# EasyEDA Pro project ProProject_温室大棚_2024-05-11.epro

# Schematic Schematic1
Create Date: 2024-05-09; Page Name: P1; Project Name: 温室大棚; Schematic Name: Schematic1; Update Date: 2024-05-10; Company: 嘉立创EDA; Page Size: A4; Version: V1.0
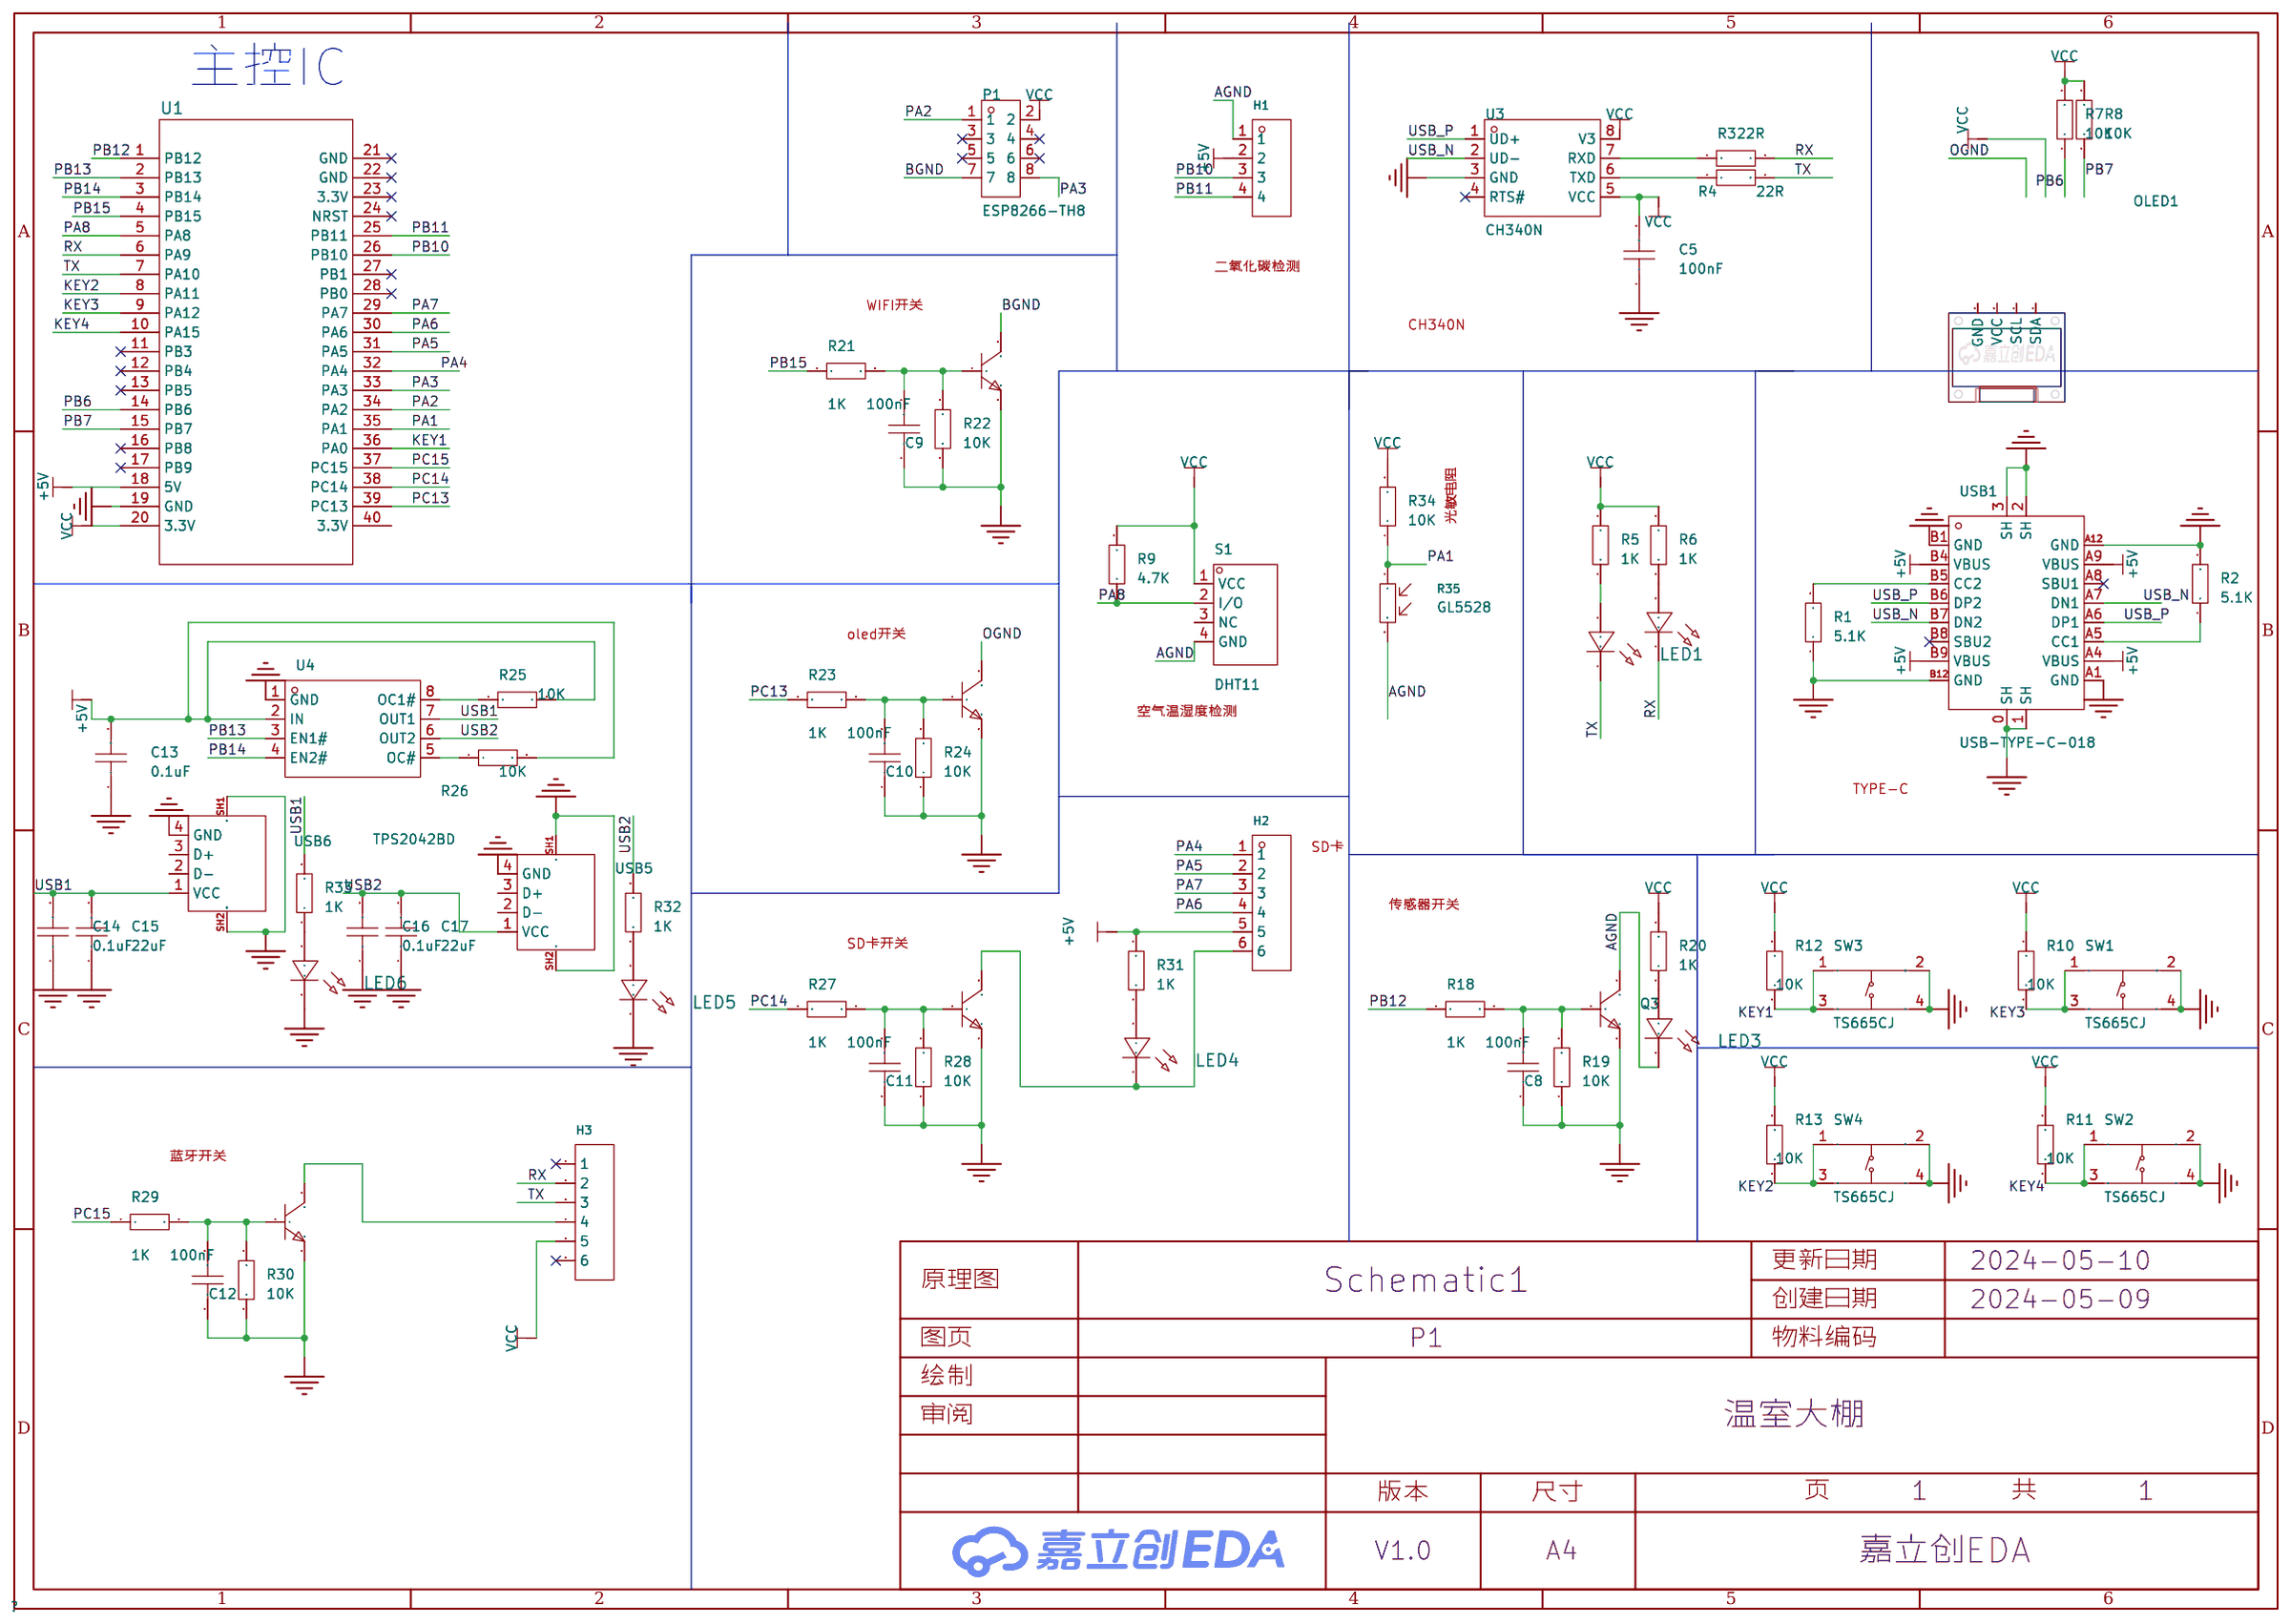
[diagram p0: schematic sheet]

## Parts
C5  100nF  [C0603]
C8  100nF  [C0603]
C9  100nF  [C0603]
C10  100nF  [C0603]
C11  100nF  [C0603]
C12  100nF  [C0603]
C13  0.1uF  [C0603]
C14  0.1uF  [C0603]
C15  22uF  [C0603]
C16  0.1uF  [C0603]
C17  22uF  [C0603]
H1  -  [HDR-TH_4P-P2.54-V-M]
H2  -  [HDR-TH_6P-P2.54-V-F]
H3  -  [HDR-TH_6P-P2.54-V-M-1]
LED1  -  [LED_0603]
LED2  -  [LED_0603]
LED3  -  [LED_0603]
LED4  -  [LED_0603]
LED5  -  [LED_0603]
LED6  -  [LED_0603]
OLED1  -  [0.96OLED_4P]
P1  ESP8266-TH8  [HDR-TH_8P-P2.54-V-F-R2-C4-S2.54-1]
Q3  -  [S8050_SOT-23]
Q4  -  [S8050_SOT-23]
Q5  -  [S8050_SOT-23]
Q6  -  [S8050_SOT-23]
Q7  -  [S8050_SOT-23]
R1  5.1K  [R0603]
R2  5.1K  [R0603]
R3  22R  [R0603]
R4  22R  [R0603]
R5  1K  [R0603]
R6  1K  [R0603]
R7  10K  [R0603]
R8  10K  [R0603]
R9  4.7K  [R0603]
R10  10K  [R0603]
R11  10K  [R0603]
R12  10K  [R0603]
R13  10K  [R0603]
R18  1K  [R0603]
R19  10K  [R0603]
R20  1K  [R0603]
R21  1K  [R0603]
R22  10K  [R0603]
R23  1K  [R0603]
R24  10K  [R0603]
R25  10K  [R0603]
R26  10K  [R0603]
R27  1K  [R0603]
R28  10K  [R0603]
R29  1K  [R0603]
R30  10K  [R0603]
R31  1K  [R0603]
R32  1K  [R0603]
R33  1K  [R0603]
R34  10K  [R0603]
R35  GL5528  [RES-TH_L5.1-W4.3-P3.40-D0.5]
S1  DHT11  [SENSOR-TH_DHT11-1]
SW1  TS665CJ  [SW-TH_4P-L6.0-W6.0-P4.50-LS6.5]
SW2  TS665CJ  [SW-TH_4P-L6.0-W6.0-P4.50-LS6.5]
SW3  TS665CJ  [SW-TH_4P-L6.0-W6.0-P4.50-LS6.5]
SW4  TS665CJ  [SW-TH_4P-L6.0-W6.0-P4.50-LS6.5]
U1  STM32F103C8T6最小系统  [STM32F103C8T6]
U3  CH340N  [SOP-8_L4.9-W3.9-P1.27-LS6.0-BL]
U4  TPS2042BD  [SOIC-8_L5.0-W4.0-P1.27-LS6.1-BL]
USB1  USB-TYPE-C-018  [USB-C_SMD-TYPE-C-31-M-12]
USB5  -  [USB_ Type-A]
USB6  -  [USB_ Type-A]

## Library data of the parts
C5 C8-C17 = CAP_0603: Supplier Footprint: 0603
H1 = HDR-M_2.54_1x4P: Supplier Part: C492403; Supplier Footprint: 插件
H2 = HDR-F_2.54_1x6P: Supplier Part: C40877; Supplier Footprint: 插件
H3 = HDR-M_2.54_1x6P: Supplier Part: C37208; Supplier Footprint: 插件
LED1-LED6 = LED_0603-R: Supplier Footprint: 0603
OLED1 = 0.96OLED模块_4P: Supplier Footprint: 插件
P1 = ESP8266-TH8: Supplier Part: C9900003199; Supplier Footprint: TH-8_4.9X10.6X2.54P; JLCPCB Part Class: 扩展库; Supplier: LCSC
Q3-Q7 = S8050_SOT_NPN: Supplier Footprint: SOT-23
R1-R13 R18-R34 = Res_0603: Supplier Footprint: 0603
R35 = GL5528: 暗电阻:1MΩ;亮电阻 @ 10Lux:8kΩ~20kΩ;光谱峰值(波长):540nm;; LCSC Part Name: 亮电阻:8kΩ~20kΩ 暗电阻:1MΩ; Supplier Part: C125627; Manufacturer: 森霸; Supplier Footprint: 插件,P=3mm; JLCPCB Part Class: 扩展库; Datasheet: https://atta.szlcsc.com/upload/public/pdf/source/20230427/842A99E3D53A83729D7968886D4EFCBB.pdf; Supplier: LCSC; Dark Resistance: 1MΩ; Illuminated Resistance @ 10Lux: 8kΩ~20kΩ; Applied Voltage: 150V; Spectral Peak: 540nm
S1 = DHT11_C87032: 温湿度模块，数字式，单总线; LCSC Part Name: DHT11  电阻式; Supplier Part: C87032; Supplier Footprint: 16.1x12.6x5.8mm; JLCPCB Part Class: 扩展库; Supplier: LCSC
SW1-SW4 = TS665CJ: 电路结构:单刀单掷;按钮形状:圆形按钮;安装方式:直插;开关长度:6mm;开关宽度:6mm;开关高度:5mm;触点电流:50mA;额定电压(DC):12V;带灯:-;机械寿命:-;; LCSC Part Name: 6*6*5mm 直插 轻触开关; Supplier Part: C393938; Manufacturer: SHOU HAN(首韩); Supplier Footprint: 插件; JLCPCB Part Class: 扩展库; Datasheet: https://atta.szlcsc.com/upload/public/pdf/source/20190521/C393938_BDABEAC600B4C55E200A80AA129B70BC.pdf; Supplier: LCSC; Circuit: 单刀单掷; Actuator Style: 圆形按钮; Mounting Style: 直插; Switch Length: 6mm; Switch Width: 6mm; Switch Height: 5mm; Contact Current: 50mA; Voltage Rating (DC): 12V
U1 = STM32F103C8T6最小系统_1
U3 = CH340N: LCSC Part Name: USB转串口芯片 CH340; Supplier Part: C2977777; Manufacturer: WCH(南京沁恒); Supplier Footprint: SOP-8; JLCPCB Part Class: 扩展库; Datasheet: https://atta.szlcsc.com/upload/public/pdf/source/20230530/6E401E9554E9F5311886CC8B3F89B62E.pdf; Supplier: LCSC
U4 = TPS2042BD: 通道数:2;输出电流:500mA;输入电压:2.7V~5.5V;导通电阻:70mΩ;; Supplier Part: C1556561; Manufacturer: TI(德州仪器); Supplier Footprint: SOIC-8; JLCPCB Part Class: 扩展库; Datasheet: https://www.ti.com/cn/lit/gpn/tps2041b; Supplier: LCSC; Number of Outputs: 2; Output Current: 500mA; Input Voltage: 2.7V~5.5V; Resistor On-State: 70mΩ; Operating Temperature	-: -40℃~+85℃
USB1 = USB-TYPE-C-018: 连接器类型:Type-C;标准:-;公母:母;端口数量:1;触点数量:16P;安装方式:卧贴;额定电流 - 电源:3A;工作温度范围:-25℃~+85℃;; LCSC Part Name: Type-C 母 卧贴; Supplier Part: C2927038; Manufacturer: DEALON(德艺隆); Supplier Footprint: SMD; JLCPCB Part Class: 扩展库; Datasheet: https://atta.szlcsc.com/upload/public/pdf/source/20211217/CCD3D517E355E8E0CC52ABD8D5784AD8.pdf; Supplier: LCSC; Connector Type: Type-C; Gender: 母; Number of Ports: 1; Number of Contacts: 16P; Mounting Style: 卧贴; Current Rating - Power (Max): 3A; Operating Temperature Range: -25℃~+85℃
USB5 USB6 = USB_ Type-A: Supplier Footprint: 插件

## Nets
+5V: C13.2 H1.2 H2.5 R25.2 R26.2 R31.2 U1.18(5V) U4.2(IN) USB1.A4(VBUS) USB1.A9(VBUS) USB1.B4(VBUS) USB1.B9(VBUS)
AGND: H1.1 LED3.1(C) Q3.3 R35.2 S1.4(GND)
GND: C5.1 C8.1 C9.1 C10.1 C11.1 C12.1 C13.1 C14.1 C15.1 C16.1 C17.1 LED5.1(C) LED6.1(C) Q3.2 Q4.2 Q5.2 Q6.2 Q7.2 R1.1 R2.2 R19.1 R22.1 R24.1 R28.1 R30.1 SW1.2(B) SW1.4(D) SW2.2(B) SW2.4(D) SW3.2(B) SW3.4(D) SW4.2(B) SW4.4(D) U1.19(GND) U3.3(GND) U4.1(GND) USB1.0(SH) USB1.1(SH) USB1.2(SH) USB1.3(SH) USB1.A1(GND) USB1.A12(GND) USB1.B1(GND) USB1.B12(GND) USB5.4(GND) USB5.SH1 USB5.SH2 USB6.4(GND) USB6.SH1 USB6.SH2
VCC: C5.2 H3.5 P1.2 R5.2 R6.2 R7.2 R8.2 R9.2 R10.2 R11.2 R12.2 R13.2 R20.2 R34.2 S1.1(VCC) U1.20(3.3V) U3.5(VCC) U3.8(V3)
BGND: P1.7 Q4.3
KEY1: R12.1 SW3.1(A) SW3.3(C) U1.36(PA0)
KEY2: R13.1 SW4.1(A) SW4.3(C) U1.8(PA11)
KEY3: R10.1 SW1.1(A) SW1.3(C) U1.9(PA12)
KEY4: R11.1 SW2.1(A) SW2.3(C) U1.10(PA15)
OGND: Q5.3
PA1: R34.1 R35.1 U1.35(PA1)
PA2: P1.1 U1.34(PA2)
PA3: P1.8 U1.33(PA3)
PA4: H2.1 U1.32(PA4)
PA5: H2.2 U1.31(PA5)
PA6: H2.4 U1.30(PA6)
PA7: H2.3 U1.29(PA7)
PA8: R9.1 S1.2(I/O) U1.5(PA8)
PB6: R7.1 U1.14(PB6)
PB7: R8.1 U1.15(PB7)
PB10: H1.3 U1.26(PB10)
PB11: H1.4 U1.25(PB11)
PB12: R18.1 U1.1(PB12)
PB13: U1.2(PB13) U4.3(EN1#)
PB14: U1.3(PB14) U4.4(EN2#)
PB15: R21.1 U1.4(PB15)
PC13: R23.1 U1.39(PC13)
PC14: R27.1 U1.38(PC14)
PC15: R29.1 U1.37(PC15)
RX: H3.2 LED2.1(C) R3.2 U1.6(PA9)
TX: H3.3 LED1.1(C) R4.2 U1.7(PA10)
USB1: C14.2 C15.2 R33.2 U4.7(OUT1) USB6.1(VCC)
USB2: C16.2 C17.2 R32.2 U4.6(OUT2) USB5.1(VCC)
USB_N: U3.2(UD-) USB1.A7(DN1) USB1.B7(DN2)
USB_P: U3.1(UD+) USB1.A6(DP1) USB1.B6(DP2)
$1N3456: R1.2 USB1.B5(CC2)
$1N3492: R2.1 USB1.A5(CC1)
$1N3904: R3.1 U3.7(RXD)
$1N3907: R4.1 U3.6(TXD)
$1N4068: LED1.2(A) R5.1
$1N4095: LED2.2(A) R6.1
$1N8530: C8.2 Q3.1 R18.2 R19.2
$1N8653: LED3.2(A) R20.1
$1N9412: C9.2 Q4.1 R21.2 R22.2
$1N9563: C10.2 Q5.1 R23.2 R24.2
$1N11609: C11.2 Q6.1 R27.2 R28.2
$1N11936: C12.2 Q7.1 R29.2 R30.2
$1N12097: H3.4 Q7.3
$1N12215: H2.6 LED4.1(C) Q6.3
$1N12331: LED4.2(A) R31.1
$1N12367: R25.1 U4.8(OC1#)
$1N12370: R26.1 U4.5(OC#)
$1N12667: LED5.2(A) R32.1
$1N12718: LED6.2(A) R33.1

Not connected (* = marked no-connect by the designer): H3 1* 6*; OLED1 1(GND) 2(VCC) 3(SCL) 4(SDA); P1 3* 4* 5* 6*; S1 3(NC); U1 11(PB3)* 12(PB4)* 13(PB5)* 16(PB8)* 17(PB9)* 21(GND)* 22(GND)* 23(3.3V)* 24(NRST)* 27(PB1)* 28(PB0)* 40(3.3V); U3 4(RTS#)*; USB1 A8(SBU1)* B8(SBU2)*; USB5 2(D-) 3(D+); USB6 2(D-) 3(D+)

## Notes on the sheet
- 主控IC
- 二氧化碳检测
- WIFI开关
- CH340N
- 光敏电阻
- oled开关
- 空气温湿度检测
- TYPE-C
- SD卡
- 传感器开关
- SD卡开关
- 蓝牙开关

# Board PCB1
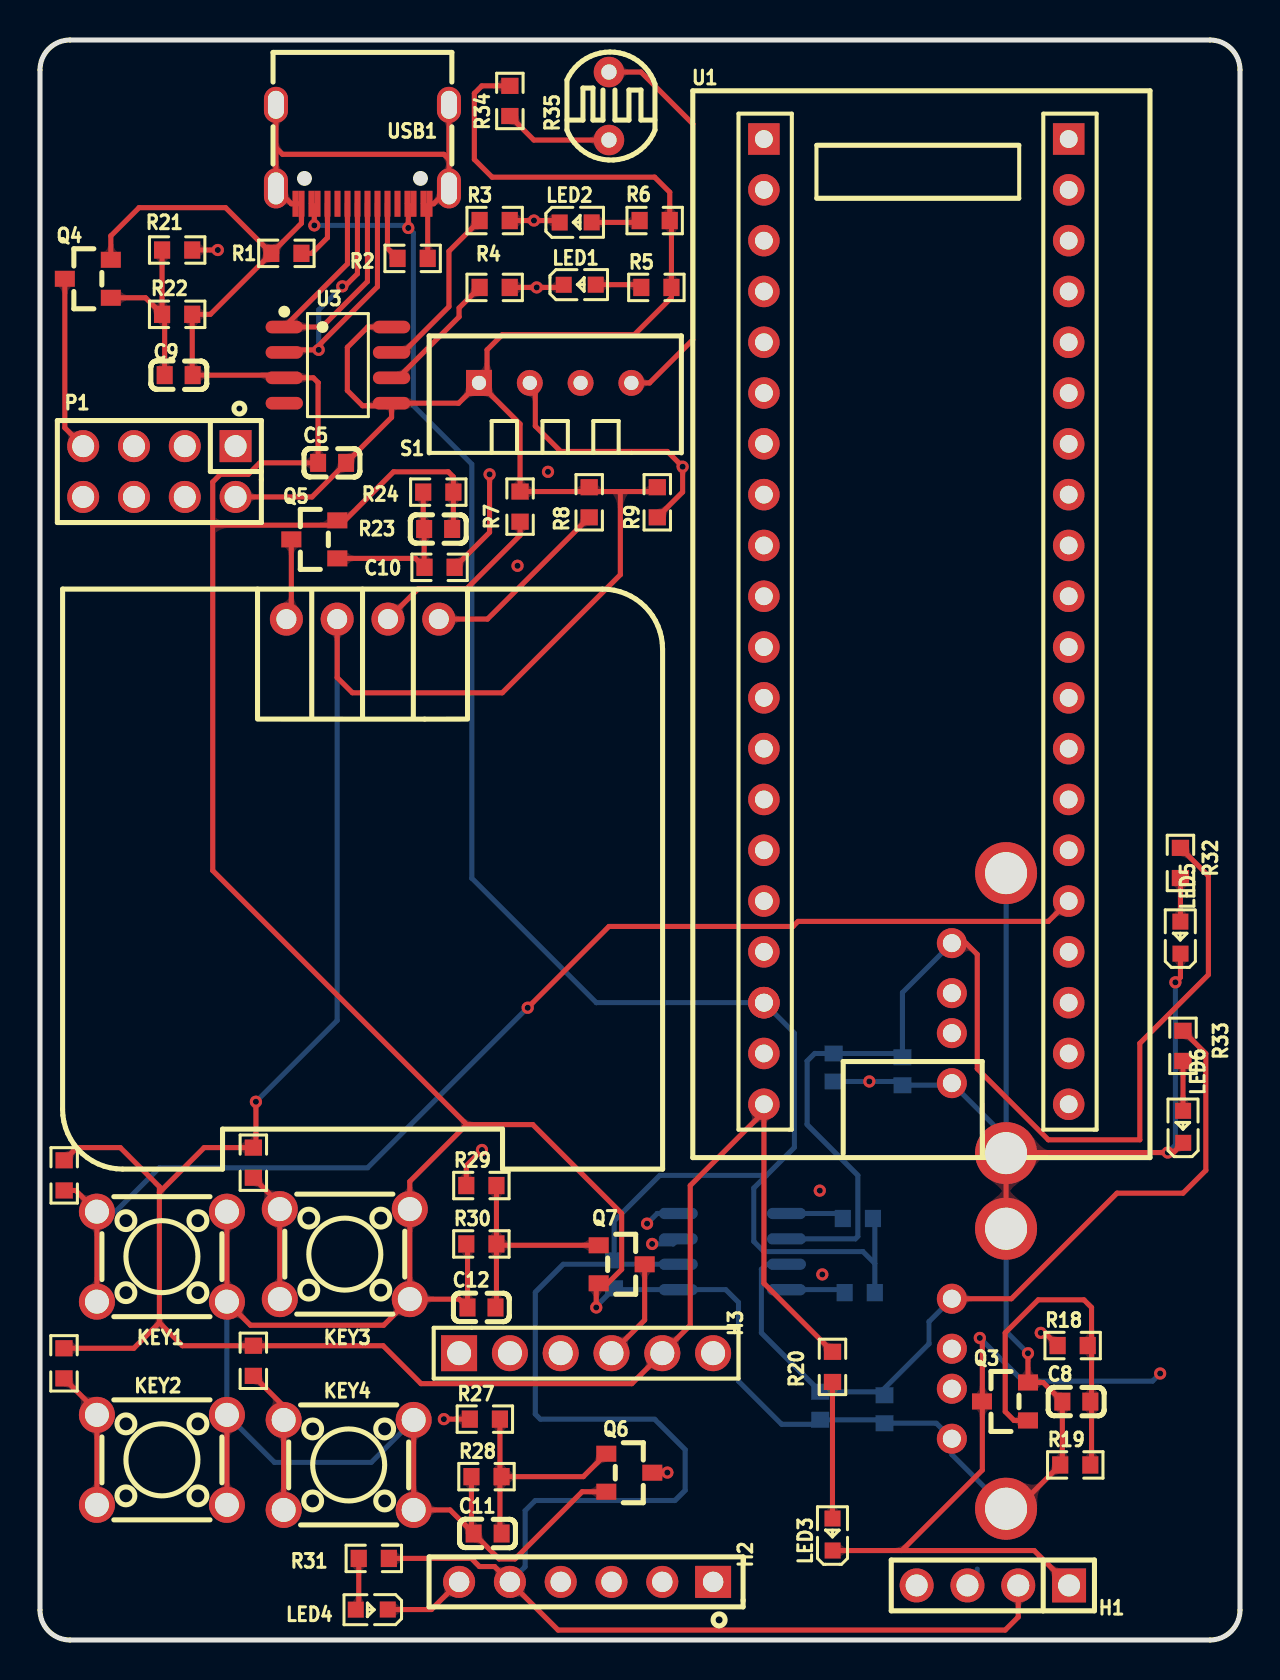
[diagram p1: board, top side]
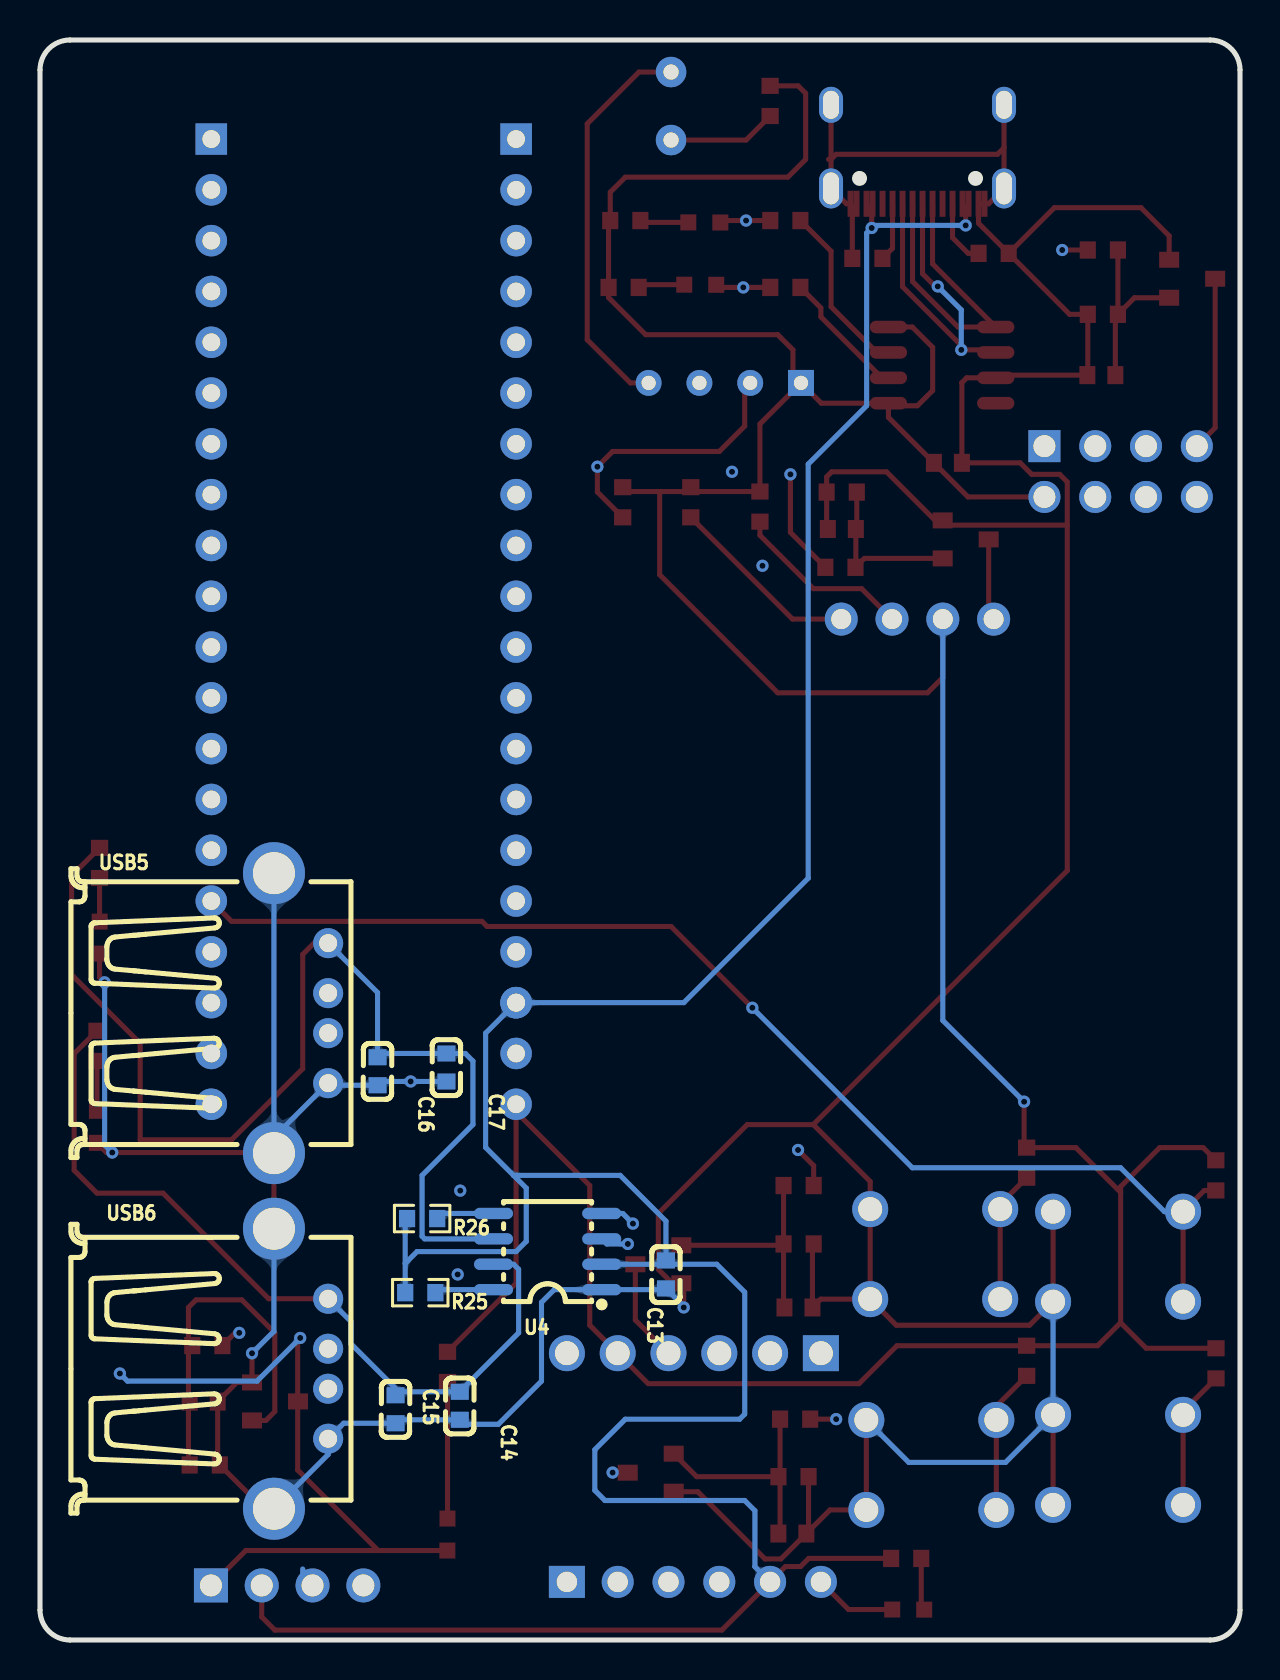
[diagram p2: board, bottom side, seen from below]

Outline 60 x 80 mm; copper layers: Top Layer, Inner1, Inner2, Bottom Layer. Coordinates in mm from the lower left corner of the outline.
Outline path: 0,78.5 0,1.5 arc(0.44,0.44) 1.5,0 58.5,0 arc(59.56,0.44) 60,1.5 60,78.5 arc(59.56,79.56) 58.5,80 1.5,80 arc(0.44,79.56) 0,78.5
Stack: Top Layer 0.035mm 外层铜厚1oz / Dielectric1 0.2104mm 7628 RC49% 8.6mil / Inner1 0.0152mm 内层铜厚 / Dielectric2 1.065mm 1.1mm H/HOZ 含铜 / Inner2 0.0152mm 内层铜厚 / Dielectric3 0.2104mm 7628 RC49% 8.6mil / Bottom Layer 0.035mm 外层铜厚1oz

## Design rules (mm)
template: JLCPCB Capability(Two Layers Board)
spacing copperThickness1oz (default): track to track 0.102, other pairs 0.152 to 0.3
spacing copperThickness2oz: track to track 0.203, other pairs 0.152 to 0.3
track width copperThickness1oz (default): min 0.127, default 0.254, max 2.54
track width copperThickness2oz: min 0.203, default 0.254, max 2.54
differential pair differentialPair (default): width min 0.127, default 0.254, max 2.54; gap min 0.152, default 0.152
via viaSize (default): diameter min 0.5, default 0.61, max 10; hole min 0.3, default 0.305, max 6.3

## Placement (name value [footprint] x y rotation side)
C5  100nF  [C0603]  14.6 58.86 0 top
C8  100nF  [C0603]  51.82 11.92 0 top
C9  100nF  [C0603]  6.93 63.24 180 top
C10  100nF  [C0603]  19.91 55.55 180 top
C11  100nF  [C0603]  22.38 5.32 0 top
C12  100nF  [C0603]  22.08 16.63 0 top
C13  0.1uF  [C0603]  28.7 18.28 90 bottom
C14  0.1uF  [C0603]  39.01 11.71 90 bottom
C15  22uF  [C0603]  42.22 11.54 90 bottom
C16  0.1uF  [C0603]  43.12 28.44 90 bottom
C17  22uF  [C0603]  39.68 28.63 90 bottom
H1  -  [HDR-TH_4P-P2.54-V-M]  47.64 2.73 180 top
H2  -  [HDR-TH_6P-P2.54-V-F]  27.31 2.91 180 top
H3  -  [HDR-TH_6P-P2.54-V-M-1]  27.31 14.34 0 top
KEY1  TS665CJ  [SW-TH_4P-L6.0-W6.0-P4.50-LS6.5]  6.1 19.17 0 top
KEY2  TS665CJ  [SW-TH_4P-L6.0-W6.0-P4.50-LS6.5]  6.1 9.01 0 top
KEY3  TS665CJ  [SW-TH_4P-L6.0-W6.0-P4.50-LS6.5]  15.24 19.29 0 top
KEY4  TS665CJ  [SW-TH_4P-L6.0-W6.0-P4.50-LS6.5]  15.43 8.75 0 top
LED1  -  [LED_0603]  27.04 67.77 0 top
LED2  -  [LED_0603]  26.83 70.89 0 top
LED3  -  [LED_0603]  39.62 5.32 90 top
LED4  -  [LED_0603]  16.54 1.51 180 top
LED5  -  [LED_0603]  57.01 35.17 90 top
LED6  -  [LED_0603]  57.15 25.71 90 top
OLED1  -  [0.96OLED_4P]  16.13 51.04 0 top
P1  ESP8266-TH8  [HDR-TH_8P-P2.54-V-F-R2-C4-S2.54-1]  5.97 58.42 180 top
Q3  -  [S8050_SOT-23]  48.25 11.8 0 top
Q4  -  [S8050_SOT-23]  2.39 67.94 0 top
Q5  -  [S8050_SOT-23]  13.72 54.9 0 top
Q6  -  [S8050_SOT-23]  29.46 8.49 180 top
Q7  -  [S8050_SOT-23]  29.08 18.91 180 top
R1  5.1K  [R0603]  12.32 69.33 0 top
R2  5.1K  [R0603]  18.63 69.08 0 top
R3  22R  [R0603]  22.73 70.97 0 top
R4  22R  [R0603]  22.73 67.63 0 top
R5  1K  [R0603]  30.82 67.63 0 top
R6  1K  [R0603]  30.73 70.97 0 top
R7  10K  [R0603]  24 56.67 90 top
R8  10K  [R0603]  27.46 56.89 90 top
R9  4.7K  [R0603]  30.86 56.89 90 top
R10  10K  [R0603]  10.67 23.87 90 top
R11  10K  [R0603]  10.67 13.96 90 top
R12  10K  [R0603]  1.21 23.23 90 top
R13  10K  [R0603]  1.2 13.83 90 top
R18  1K  [R0603]  51.63 14.72 0 top
R19  10K  [R0603]  51.76 8.75 0 top
R20  1K  [R0603]  39.62 13.66 90 top
R21  1K  [R0603]  6.86 69.5 180 top
R22  10K  [R0603]  6.86 66.28 180 top
R23  1K  [R0603]  19.98 53.63 180 top
R24  10K  [R0603]  19.91 57.39 180 top
R25  10K  [R0603]  40.99 17.37 0 bottom
R26  10K  [R0603]  40.89 21.07 0 bottom
R27  1K  [R0603]  22.24 11.04 0 top
R28  10K  [R0603]  22.32 8.17 0 top
R29  1K  [R0603]  22.07 22.72 0 top
R30  10K  [R0603]  22.07 19.8 0 top
R31  1K  [R0603]  16.69 4.08 0 top
R32  1K  [R0603]  57.02 38.85 90 top
R33  1K  [R0603]  57.15 29.71 90 top
R34  10K  [R0603]  23.49 76.95 90 top
R35  GL5528  [RES-TH_L5.1-W4.3-P3.40-D0.5]  28.45 76.7 180 top
S1  DHT11  [SENSOR-TH_DHT11-1]  25.76 62.86 0 top
U1  STM32F103C8T6最小系统  [STM32F103C8T6]  45.21 62.47 0 top
U3  CH340N  [SOP-8_L4.9-W3.9-P1.27-LS6.0-BL]  14.9 63.74 270 top
U4  TPS2042BD  [SOIC-8_L5.0-W4.0-P1.27-LS6.1-BL]  34.62 19.42 90 bottom
USB1  USB-TYPE-C-018  [USB-C_SMD-TYPE-C-31-M-12]  16.12 74.28 180 top
USB5  -  [USB_ Type-A]  51.05 31.36 270 bottom
USB6  -  [USB_ Type-A]  51.05 13.58 270 bottom

## Footprints (pads in the part's own frame, mm; a bottom-side part is the same pattern mirrored in y, then rotated)
0.96OLED_4P
  round 1.65 hole 1: 1(-3.81,-0.002) 2(-1.27,0.002) 3(1.27,0.002) 4(3.81,0.002)
C0603
  rect 0.8x0.9 smd: 1(-0.7,0) 2(0.7,0)
HDR-TH_4P-P2.54-V-M
  rect 1.7x1.7 hole 1.1: 1(-3.81,0)
  round 1.7 hole 1.1: 2(-1.27,0) 3(1.27,0) 4(3.81,0)
HDR-TH_6P-P2.54-V-F
  rect 1.8x1.6 hole 1.02: 1(-6.35,0)
  round 1.6 hole 1.02: 2(-3.81,0) 3(-1.27,0) 4(1.27,0) 5(3.81,0) 6(6.35,0)
HDR-TH_6P-P2.54-V-M-1
  rect 1.8x1.8 hole 1.2: 1(-6.35,0)
  round 1.8 hole 1.2: 2(-3.81,0) 3(-1.27,0) 4(1.27,0) 5(3.81,0) 6(6.35,0)
HDR-TH_8P-P2.54-V-F-R2-C4-S2.54-1
  rect 1.6x1.6 hole 1.1: 1(-3.81,-1.27)
  round 1.6 hole 1.1: 2(-3.81,1.27) 3(-1.27,-1.27) 4(-1.27,1.27) 5(1.27,-1.27) 6(1.27,1.27) 7(3.81,-1.27) 8(3.81,1.27)
LED_0603
  rect 0.8x0.8 smd: 1(-0.851,-0.01) 2(0.75,-0.005)
R0603
  rect 0.806x0.864 smd: 1(-0.753,0) 2(0.753,0)
RES-TH_L5.1-W4.3-P3.40-D0.5
  round 1.524 hole 0.762: 1(0,1.7) 2(0,-1.7)
S8050_SOT-23
  rect 1x0.8 smd: 1(1.15,-0.823) 2(1.15,1.077) 3(-1.15,0.127)
SENSOR-TH_DHT11-1
  rect 1.296x1.296 hole 0.711: 1(-3.81,0)
  round 1.296 hole 0.711: 2(-1.27,0) 3(1.27,0) 4(3.81,0)
SOIC-8_L5.0-W4.0-P1.27-LS6.1-BL
  oval 0.569x1.95 smd: 1(-1.905,-2.705) 2(-0.635,-2.705) 3(0.635,-2.705) 4(1.905,-2.705) 5(1.905,2.705) 6(0.635,2.705) 7(-0.635,2.705) 8(-1.905,2.705)
SOP-8_L4.9-W3.9-P1.27-LS6.0-BL
  oval 0.63x1.865 smd: 1(-1.905,-2.683) 2(-0.635,-2.683) 3(0.635,-2.683) 4(1.905,-2.683) 5(1.905,2.683) 6(0.635,2.683) 7(-0.635,2.683) 8(-1.905,2.683)
STM32F103C8T6
  rect 1.575x1.575 hole 0.889: 1(-9.017,12.573) 21(6.223,12.573)
  round 1.575 hole 0.889: 2(-9.017,10.033) 3(-9.017,7.493) 4(-9.017,4.953) 5(-9.017,2.413) 6(-9.015,-0.126) 7(-9.017,-2.667) 8(-9.017,-5.207) 9(-9.017,-7.747) 10(-9.017,-10.287) 11(-9.017,-12.827) 12(-9.017,-15.367) 13(-9.017,-17.907) 14(-9.017,-20.447) 15(-9.017,-22.987) 16(-9.017,-25.527) 17(-9.017,-28.067) 18(-9.017,-30.607) 18(-9.017,-30.607) 19(-9.017,-33.147) 20(-9.017,-35.687) 22(6.223,10.033) 23(6.223,7.493) 24(6.223,4.953) 25(6.223,2.413) 26(6.223,-0.127) 27(6.223,-2.667) 28(6.223,-5.207) 29(6.223,-7.747) 30(6.223,-10.287) 31(6.223,-12.827) 32(6.223,-15.367) 33(6.223,-17.907) 34(6.223,-20.447) 35(6.223,-22.987) 36(6.223,-25.527) 37(6.223,-28.067) 38(6.223,-30.607) 39(6.223,-33.147) 40(6.223,-35.687)
SW-TH_4P-L6.0-W6.0-P4.50-LS6.5
  round 1.8 hole 1.2: 1(-3.25,2.25) 2(3.25,2.25) 3(-3.25,-2.25) 4(3.25,-2.25)
USB-C_SMD-TYPE-C-31-M-12
  oval 1.2x2 hole 0.8x1.6: 0(-4.325,1.706) 1(4.325,1.706)
  oval 1.2x1.8 hole 0.8x1.4: 2(4.325,-2.474) 3(-4.325,-2.474)
  rect 0.3x1.3 smd: A1(-3.35,2.474) A4(-2.55,2.474) A5(-1.25,2.474) A6(-0.25,2.474) A7(0.25,2.474) A8(1.25,2.474) A9(2.55,2.474) A12(3.35,2.474) B1(3.05,2.474) B4(2.25,2.474) B5(1.75,2.474) B6(0.75,2.474) B7(-0.75,2.474) B8(-1.75,2.474) B9(-2.25,2.474) B12(-3.05,2.474)
USB_ Type-A
  round 1.5 hole 0.9: 1(-3.484,5.461) 2(-0.984,5.461) 3(1.016,5.461) 4(3.516,5.461)
  round 3.1 hole 2.1: SH1(7.016,2.751) SH2(-6.984,2.751)

## Nets
As in the schematic, except:
GND: C5.1 C8.1 C9.1 C10.1 C11.1 C12.1 C13.1 C14.1 C15.1 C16.1 C17.1 KEY1.2 KEY1.4 KEY2.2 KEY2.4 KEY3.2 KEY3.4 KEY4.2 KEY4.4 LED5.1 LED6.1 Q3.2 Q4.2 Q5.2 Q6.2 Q7.2 R1.1 R2.2 R19.1 R22.1 R24.1 R28.1 R30.1 U1.19 U3.3 U4.1 USB1.0 USB1.1 USB1.2 USB1.3 USB1.A1 USB1.A12 USB1.B1 USB1.B12 USB5.4 USB5.SH1 USB5.SH2 USB6.4 USB6.SH1 USB6.SH2
VCC: C5.2 H3.5 OLED1.2 P1.2 R5.2 R6.2 R7.2 R8.2 R9.2 R10.2 R11.2 R12.2 R13.2 R20.2 R34.2 S1.1 U1.20 U3.5 U3.8
KEY1: KEY1.1 KEY1.3 R12.1 U1.36
KEY2: KEY2.1 KEY2.3 R13.1 U1.8
KEY3: KEY3.1 KEY3.3 R10.1 U1.9
KEY4: KEY4.1 KEY4.3 R11.1 U1.10
OGND: OLED1.1 Q5.3
PB6: OLED1.3 R7.1 U1.14
PB7: OLED1.4 R8.1 U1.15

Pads without a net: H3 1 6; P1 3 4 5 6; S1 3; U1 11 12 13 16 17 21 22 23 24 27 28 40; U3 4; USB1 A8 B8; USB5 2 3; USB6 2 3

## Via types
v1: diameter 0.61, hole 0.305, Top Layer to Bottom Layer, 28 vias

## Routing (per net, layer and track width the routed paths; a pad name or vN(x,y) marks a point on that pad's centre or on a via; arc(x,y) is an arc through that point)
+5V: length 163.7
  Top Layer w0.254: R31.2 21.56,4.08 21.97,3.67 22.73,3.67 H2.5 25.9,0.5 48.26,0.5 48.91,1.15 H1.2 ; USB1.B9 18.41,71.77 v1(18.41,70.6) ; USB1.A9 13.72,71.67 v1(13.72,70.73)
  Bottom Layer w0.254: H2.5 24.26,3.67 24.26,6.47 24.76,6.97 31.75,6.97 32.26,7.48 32.26,9.51 30.73,11.04 25.02,11.04 24.76,11.29 24.76,17.39 26.16,18.79 28.51,18.79 C13.2 ; 36.32,23.23 37.72,24.63 37.72,30.34 U1.18 27.81,31.87 21.59,38.09 21.59,58.79 18.67,61.71 18.67,70.35 v1(18.41,70.6) 18.29,70.73 v1(13.72,70.73) ; 36.32,23.23 30.99,23.23 28.7,20.94 C13.2 ; 36.32,23.23 35.69,22.6 35.69,19.93 36.19,19.42 41.15,19.42 41.74,18.83 ; 41.74,18.83 41.74,20.98 R26.2 ; 41.74,18.83 R25.2 ; C13.2 28.89,18.79 U4.2
AGND: length 145.7
  Top Layer w0.254: S1.4 30.48,62.86 32.64,65.01 32.64,75.81 30.05,78.4 R35.2 ; 47.12,11.91 47.12,8.5 43.09,4.47 ; 47.12,11.91 Q3.3 ; 47.12,11.91 47.12,14.98 v1(46.99,15.1) ; 43.09,4.47 49.71,4.47 H1.1 ; 43.09,4.47 LED3.1
  Inner2 w0.254: R35.2 28.75,78.09 52.96,78.09 53.21,77.84 53.21,73.52 54.99,71.75 54.99,14.34 v1(56.01,13.32)
  Bottom Layer w0.254: v1(46.99,15.1) 49.15,12.94 55.63,12.94 v1(56.01,13.32)
GND: length 299.4
  Top Layer w0.254: R2.2 19.38,71.6 USB1.B12 ; 21.57,5.43 20.5,6.5 KEY4.4 KEY4.2 ; 21.57,5.43 C11.1 22.95,4.05 23.75,4.05 27.11,7.41 Q6.2 ; 21.57,5.43 R28.1 ; USB1.3 20.45,74.03 ; 20.45,74.03 20.57,74.03 ; 20.45,74.03 20.19,74.28 12.13,74.28 11.8,74.61 ; 20.45,74.03 USB1.0 19.68,71.81 USB1.A1 ; Q4.2 3.54,70.21 4.95,71.62 9.28,71.62 R1.1 ; R1.1 13.07,70.84 USB1.B1 USB1.A12 12.57,71.81 USB1.1 11.8,74.61 ; R1.1 8.52,66.28 R22.1 7.61,63.27 C9.1 12.08,63.24 U3.3 13.67,63.11 13.91,62.86 13.91,62.86 C5.1 10.99,58.86 10.41,58.28 9.02,58.28 8.64,57.9 8.64,55.74 ; 21.34,25.77 24.64,25.77 29.08,21.33 29.08,18.53 28.39,17.84 Q7.2 27.81,17.72 v1(27.81,16.63) ; 21.34,25.77 8.64,38.47 8.64,55.74 ; 21.34,25.77 18.49,22.92 KEY3.2 KEY3.4 ; 8.64,55.74 14.63,55.74 Q5.2 15.25,55.98 17.68,58.41 20.41,58.41 20.67,58.16 R24.1 20.67,55.61 C10.1 ; 11.8,74.61 USB1.2 ; KEY2.2 KEY2.4 ; 48.3,20.56 48.3,24.34 48.33,24.37 v1(56.39,24.37) 56.68,24.37 LED6.1 ; LED5.1 57.02,33.14 v1(56.77,32.88) ; 49.4,14.34 v1(49.4,14.34) Q3.2 50.16,12.88 C8.1 51.12,8.86 R19.1 48.82,6.56 USB6.SH1 ; KEY1.2 KEY1.4 10.53,15.74 17.18,15.74 KEY3.4 ; KEY3.4 20.96,17.04 C12.1 21.38,19.74 R30.1
  Inner2 w0.254: U1.19 40.07,29.33 v1(41.47,27.93)
  Bottom Layer w0.254: KEY4.2 16.56,8.88 11.72,8.88 KEY2.2 KEY1.4 ; 48.3,20.56 48.3,15.43 v1(49.4,14.34) ; v1(27.81,16.63) 27.81,16.69 C13.1 28.76,17.52 U4.1 34.29,17.52 34.93,16.88 34.93,12.94 37.08,10.78 38.78,10.78 C14.1 42.05,11.01 C15.1 44.82,10.84 USB6.4 45.59,9.27 USB6.SH1 ; v1(56.39,24.37) 56.77,24.75 v1(56.77,32.88) ; 48.3,25.13 45.59,27.84 45.49,27.74 C16.1 42.93,27.93 v1(41.47,27.93) 39.68,27.93 ; 48.3,25.13 48.3,38.34 ; 48.3,25.13 48.3,24.34
  vias: v1(23.88,53.71) v1(25.4,58.41) v1(38.99,22.47) v1(39.12,18.28)
VCC: length 199.4
  Top Layer w0.254: 36.19,26.41 32.51,22.72 32.51,15.74 H3.5 29.59,12.82 19.05,12.82 17.15,14.71 R11.2 7.12,14.71 5.97,15.87 ; 36.19,26.41 36.19,17.84 R20.2 ; 36.19,26.41 U1.20 ; R9.2 30.65,57.42 29.02,57.42 ; 29.02,57.42 29.02,53.26 23.11,47.36 15.62,47.36 14.86,48.12 14.86,51.05 ; 29.02,57.42 R7.2 24,60.8 S1.1 ; 5.97,22.38 5.97,15.87 ; 5.97,22.38 5.97,22.66 4.01,24.62 1.84,24.62 R12.2 ; 5.97,22.38 8.21,24.62 R10.2 10.79,24.75 v1(10.79,26.91) ; 5.97,15.87 4.69,14.59 R13.2 ; U3.5 17.45,61.71 16.13,61.71 15.37,62.47 15.37,64.63 16.38,65.65 U3.8 ; U3.5 20.93,61.84 S1.1 ; U3.5 17.58,61.13 C5.2 13.6,57.15 P1.2 ; S1.1 22.35,63.26 22.35,64.51 23.11,65.27 29.72,65.27 31.57,67.12 R5.2 31.57,70.89 R6.2 31.49,72.39 30.73,73.14 22.61,73.14 21.72,74.03 21.72,77.33 22.09,77.71 R34.2
  Bottom Layer w0.254: v1(10.79,26.91) 14.86,30.98 14.86,51.05
BGND: length 8.7
  Top Layer w0.254: 2.16,59.69 1.24,60.61 Q4.3
KEY1: length 61.6
  Top Layer w0.254: R12.1 1.79,22.48 KEY1.1 KEY1.3 ; v1(24.38,31.61) 28.45,35.68 37.65,35.68 37.9,35.93 50.42,35.93 U1.36
  Bottom Layer w0.254: v1(24.38,31.61) 16.38,23.61 5.97,23.61 3.77,21.42 KEY1.1
KEY2: length 79.8
  Top Layer w0.254: R13.1 2.85,11.43 KEY2.1 KEY2.3
  Inner1 w0.254: KEY2.1 3.52,11.26 5.97,13.71 5.97,48.5 12.32,54.85 31.62,54.85 34.04,57.27 U1.8
KEY3: length 49.8
  Top Layer w0.254: R10.1 11.99,21.79 KEY3.1 KEY3.3
  Inner1 w0.254: KEY3.1 11.99,30.52 U1.9
KEY4: length 58.5
  Top Layer w0.254: KEY4.3 KEY4.1 12.18,11.69 R11.1
  Inner1 w0.254: KEY4.1 14.99,13.81 14.99,21.33 18.16,24.5 18.16,34.15 U1.10
OGND: length 4.1
  Top Layer w0.254: OLED1.1 12.57,51.29 Q5.3
PA1: length 68.1
  Top Layer w0.254: R34.1 24.69,75 R35.1
  Inner2 w0.254: U1.35 53.09,41.14 53.09,45.08 52.45,45.71 49.53,45.71 48.9,46.34 48.9,76.19 47.88,77.21 35.69,77.21 33.48,75 R35.1
PA2: length 49
  Inner2 w0.254: P1.1 22.97,59.69 34.16,48.5 40.64,48.5 47.12,42.03 U1.34
PA3: length 59.6
  Inner2 w0.254: U1.33 46.61,44.57 40.13,51.04 33.78,51.04 23.37,61.46 3.81,61.46 3.3,60.95 3.3,58.3 2.16,57.15
PA4: length 63.3
  Inner2 w0.254: U1.32 52.32,47.11 53.72,45.71 53.72,7.1 51.35,4.73 35.48,4.73 H2.1
PA5: length 70.6
  Inner2 w0.254: H2.2 33.01,1.01 34.67,1.01 37.72,4.05 52.2,4.05 54.1,5.96 54.1,46.98 U1.31
PA6: length 69.3
  Inner1 w0.254: U1.30 52.96,50.66 52.96,22.09 47.62,16.75 47.62,10.4 45.09,7.86 31.92,7.86 26.96,2.91 H2.4
PA7: length 70
  Inner1 w0.254: U1.29 53.47,52.69 53.47,21.45 48.26,16.25 48.26,10.53 44.7,6.97 32.64,6.97 H2.3
PA8: length 21.7
  Top Layer w0.254: S1.2 24.76,62.58 24.76,60.7 26.03,59.43 31.37,59.43 v1(32.13,58.66) 32.13,57.4 R9.1
  Inner2 w0.254: v1(32.13,58.66) 34.16,60.7 34.16,63.36 35.31,64.51 35.81,64.51 U1.5
PB6: length 32.8
  Top Layer w0.254: OLED1.3 18.92,52.57 21.34,52.57 24,55.23 R7.1
  Inner2 w0.254: OLED1.3 18.92,52.57 20.7,52.57 31.24,42.03 U1.14
PB7: length 30.7
  Top Layer w0.254: R8.1 22.37,51.05 OLED1.4
  Inner2 w0.254: OLED1.4 31.5,39.49 U1.15
PB10: length 67.5
  Inner1 w0.254: U1.26 54.89,58.89 54.89,8.02 51.31,4.44 48.08,4.44 H1.3
  Bottom Layer w0.254: 46.86,3.55 46.86,3.22 H1.3
PB11: length 76.2
  Inner1 w0.254: U1.25 55.4,60.92 55.4,6.75 53.47,4.82 53.47,2.02 52.32,0.88 45.68,0.88 H1.4
PB12: length 71.5
  Top Layer w0.254: R18.1 50.24,15.36 v1(50.04,15.36)
  Inner1 w0.254: U1.1 50.16,61.08 50.16,56 52.71,56 54.23,54.47 54.23,19.55 v1(50.04,15.36)
PB13: length 98.1
  Inner2 w0.254: v1(30.61,19.8) 30.1,19.8 0.51,49.39 0.51,64.89 4.44,68.82 11.56,68.82 12.32,69.59 33.27,69.59 U1.2
  Bottom Layer w0.254: U4.3 31.66,19.8 v1(30.61,19.8)
PB14: length 95
  Inner2 w0.254: v1(30.35,20.82) 1.02,50.16 1.02,64.38 4.83,68.19 13.08,68.19 13.72,68.82 35.05,68.82 U1.3
  Bottom Layer w0.254: U4.4 30.86,21.33 v1(30.35,20.82)
PB15: length 35.6
  Top Layer w0.254: R21.1 v1(8.89,69.5)
  Inner1 w0.254: v1(8.89,69.5) 8.89,73.14 10.16,74.41 22.05,74.41 24.97,71.49 31.23,71.49 35.16,67.55 36.07,67.55 U1.4
PC13: length 51
  Top Layer w0.254: v1(22.48,58.28) 22.48,55.38 R23.1
  Inner2 w0.254: U1.39 49.91,29.33 48.51,30.72 48.51,34.15 39.24,43.42 32.77,43.42 22.48,53.71 v1(22.48,58.28)
PC14: length 46.3
  Top Layer w0.254: R27.1 v1(20.19,11.04)
  Inner1 w0.254: U1.38 49.78,31.87 48.39,30.47 48.39,27.55 44.58,23.74 41.91,23.74 37.21,19.04 37.21,13.2 35.06,11.04 v1(20.19,11.04)
PC15: length 58.3
  Top Layer w0.254: R29.1 21.32,23.72 v1(22.1,24.5)
  Inner2 w0.254: U1.37 52.71,33.14 52.71,17.9 50.8,15.99 23.37,15.99 22.1,17.26 v1(22.1,24.5)
RX: length 80.5
  Top Layer w0.254: R3.2 v1(24.7,70.97) 25.89,70.97 LED2.1
  Inner1 w0.254: v1(24.7,70.97) 31.12,70.97 33.02,69.08 33.02,63.74 34.42,62.35 U1.6 39.24,59.3 39.24,23.99 37.97,22.72 31.12,22.72 23.5,15.1 H3.2
TX: length 84.6
  Top Layer w0.254: LED1.1 26.05,67.63 v1(24.84,67.63) R4.2
  Inner1 w0.254: v1(24.84,67.63) 31.17,67.63 32.26,66.54 32.26,61.58 34.04,59.81 U1.7 38.61,57.39 38.61,24.37 37.59,23.36 30.84,23.36 22.22,14.74 22.22,12.94 22.86,12.31 25.4,12.31 26.03,12.94 H3.3
USB1: length 40.9
  Top Layer w0.254: USB6.1 48.57,17.06 53.85,22.34 57.15,22.34 58.29,23.48 58.29,29.32 R33.2
  Bottom Layer w0.254: U4.7 36.32,18.79 36.07,18.53 36.07,15.36 39.01,12.42 C14.2 42.05,12.41 ; 42.05,12.41 44.45,14.81 44.45,15.92 USB6.1 ; 42.05,12.41 C15.2
USB2: length 58.6
  Top Layer w0.254: R32.2 58.42,38.21 58.42,33.26 54.99,29.83 54.99,25.01 50.42,25.01 46.86,28.56 46.86,34.28 46.3,34.84 45.59,34.84
  Bottom Layer w0.254: 45.59,34.84 43.12,32.37 C16.2 42.93,29.33 C17.2 38.74,29.33 38.35,28.95 38.35,25.77 40.89,23.23 40.89,20.18 40.77,20.06 U4.6
USB_N: length 18.4
  Top Layer w0.254: USB1.A7 15.87,68.31 15.24,67.68 v1(15.11,67.68) ; U3.2 12.34,64.51 13.72,64.51 16.87,67.66 USB1.B7
  Bottom Layer w0.254: v1(13.94,64.51) 13.94,66.5 v1(15.11,67.68)
USB_P: length 16.5
  Top Layer w0.254: USB1.B6 15.37,68.81 U3.1 14.1,65.65 16.37,67.93 USB1.A6
$1N3456: length 3.3
  Top Layer w0.254: R1.2 13.59,69.33 14.37,70.12 USB1.B5
$1N3492: length 2.9
  Top Layer w0.254: R2.1 17.37,69.58 USB1.A5
$1N3904: length 8.8
  Top Layer w0.254: R3.1 20.45,69.44 20.45,66.67 18.16,64.38 U3.7
$1N3907: length 6.5
  Top Layer w0.254: R4.1 20.96,66.6 20.96,66.16 17.91,63.11 U3.6
$1N4068: length 2.3
  Top Layer w0.254: LED1.2 29.93,67.77 R5.1
$1N4095: length 2.4
  Top Layer w0.254: R6.1 29.89,70.88 LED2.2
$1N8530: length 18.3
  Top Layer w0.254: Q3.1 48.7,10.98 48.26,11.42 48.26,15.36 49.91,17.01 52.2,17.01 52.58,16.63 52.58,8.81 R19.2
$1N8653: length 6.8
  Top Layer w0.254: LED3.2 39.62,6.08 R20.1
$1N9412: length 9.2
  Top Layer w0.254: R22.2 R21.2 ; R22.2 6.23,66.16 C9.2 ; R22.2 5.28,67.11 Q4.1
$1N9563: length 8.3
  Top Layer w0.254: 19.21,53.65 C10.2 19.16,55.6 R24.2 ; 19.21,53.65 18.78,54.08 Q5.1 ; 19.21,53.65 R23.2
$1N11609: length 11.5
  Top Layer w0.254: R27.2 23,5.41 C11.2 ; R28.2 27.17,8.17 Q6.1
$1N11936: length 11.3
  Top Layer w0.254: R30.2 22.82,16.67 C12.2 ; R30.2 22.89,19.74 Q7.1 ; R30.2 R29.2
$1N12097: length 5.1
  Top Layer w0.254: H3.4 30.23,16 Q7.3
$1N12215: length 17.6
  Top Layer w0.254: Q6.3 31.36,8.36 v1(31.37,8.37) ; H2.6 19.57,1.52 17.39,1.52
  Inner1 w0.254: v1(31.37,8.37) 27.56,8.37 23.24,4.05 22.1,4.05 H2.6
$1N12331: length 2.6
  Top Layer w0.254: LED4.2 15.94,1.67 R31.1
$1N12367: length 3
  Bottom Layer w0.254: U4.8 40.09,17.52 R25.1
$1N12370: length 2.9
  Bottom Layer w0.254: U4.5 39.89,21.33 R26.1
$1N12667: length 2.2
  Top Layer w0.254: R32.1 57.02,35.92 LED5.2
$1N12718: length 2.5
  Top Layer w0.254: R33.1 57.15,26.46 LED6.2

## Copper pours and planes (outline as drawn; the poured copper is in the pictures)
GND on Top Layer: -4.95,83.17 82.17,83.17 82.17,-15.76 -4.95,-15.76
GND on Bottom Layer: -6.73,84.06 77.47,84.06 77.47,-7.25 -6.73,-7.25

Small or netless copper shapes (teardrops, artwork), in the pictures only: 246 on Top Layer, 74 on Bottom Layer, 30 on Inner1, 28 on Inner2
